# Altium project 2020Masterboard.PrjPcb
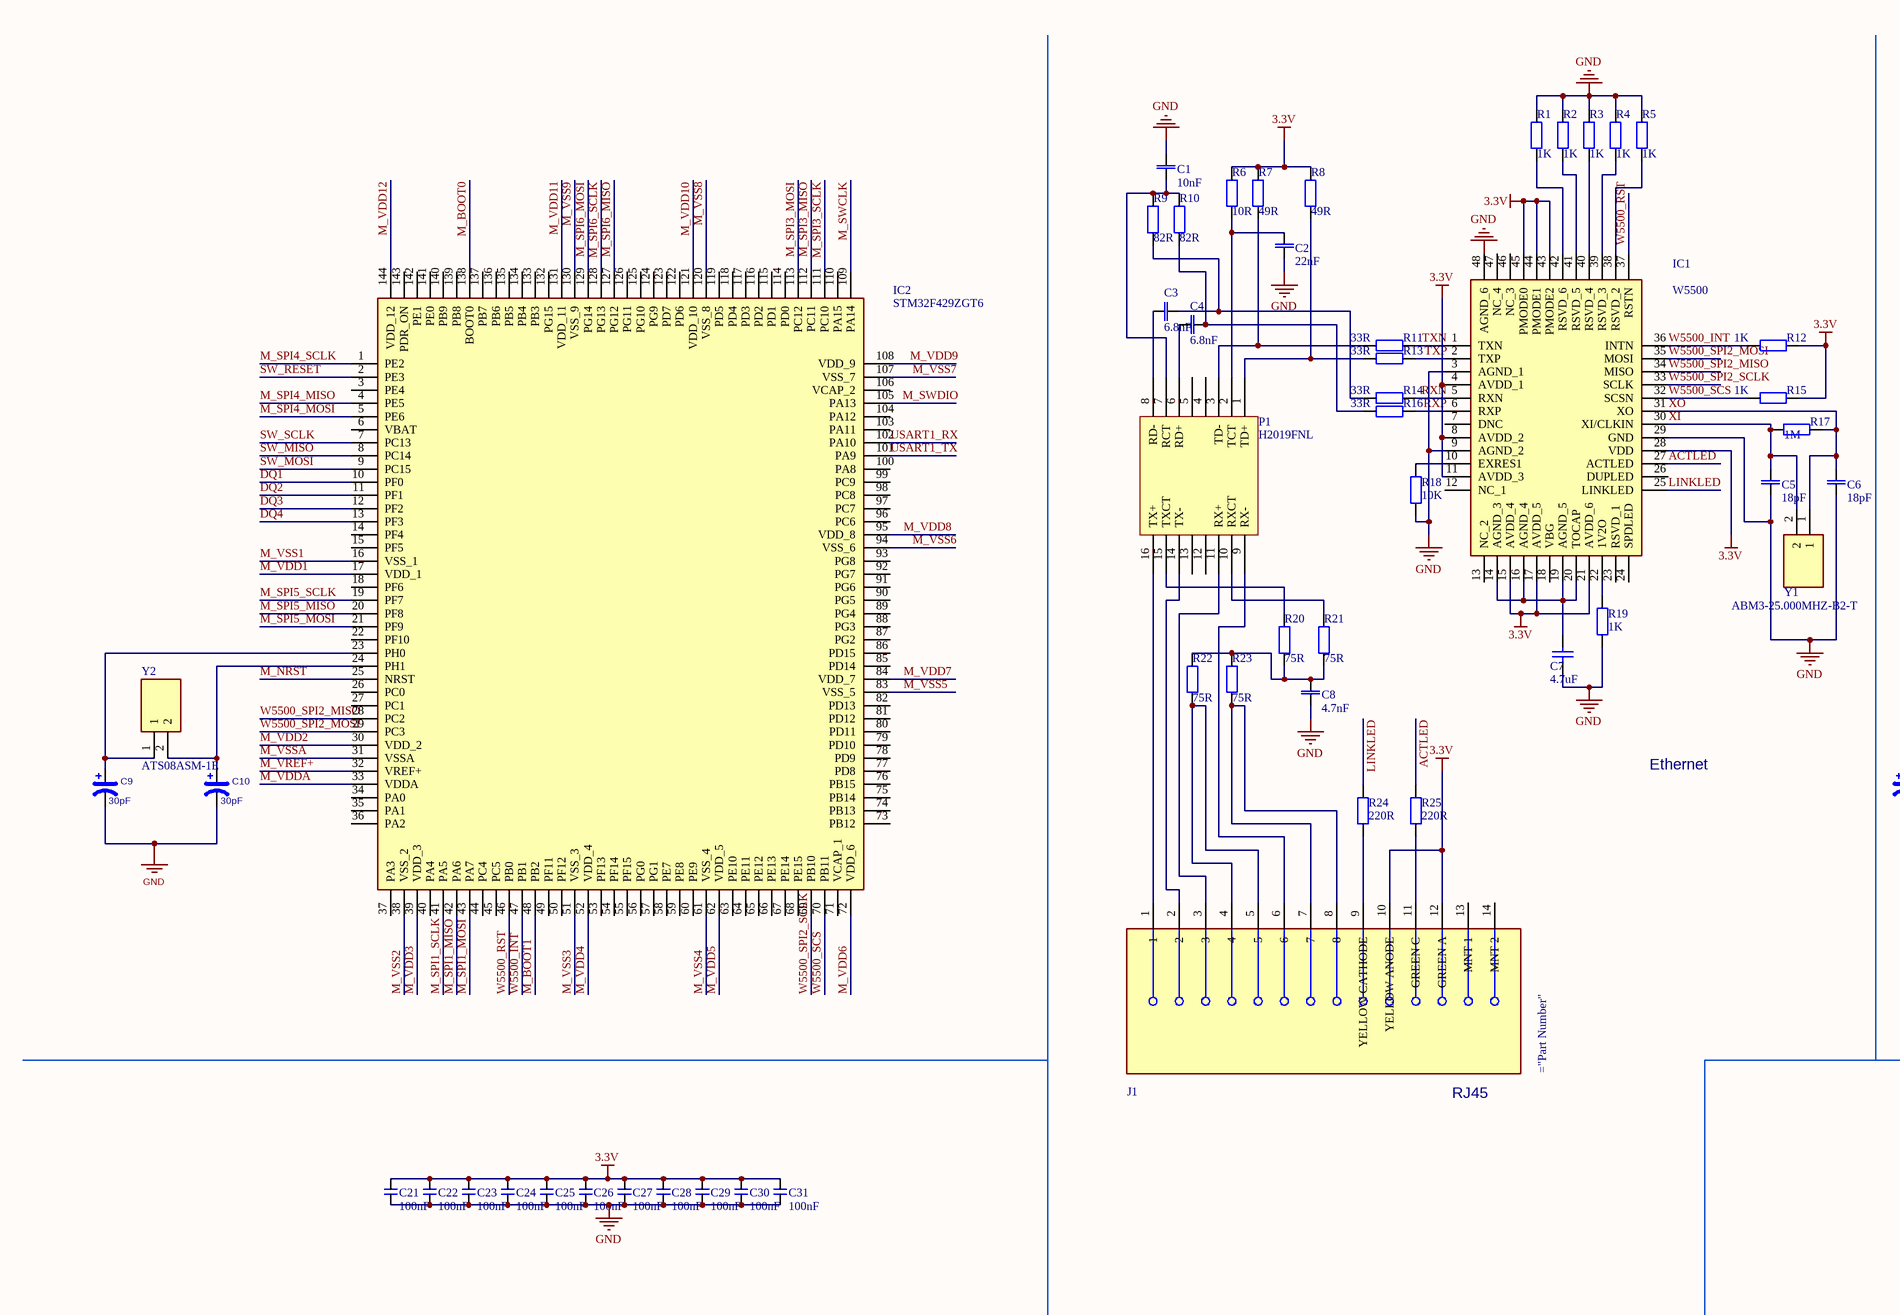
[diagram p0: all_Masterboard_2020.SchDoc, top column 1 of 4]
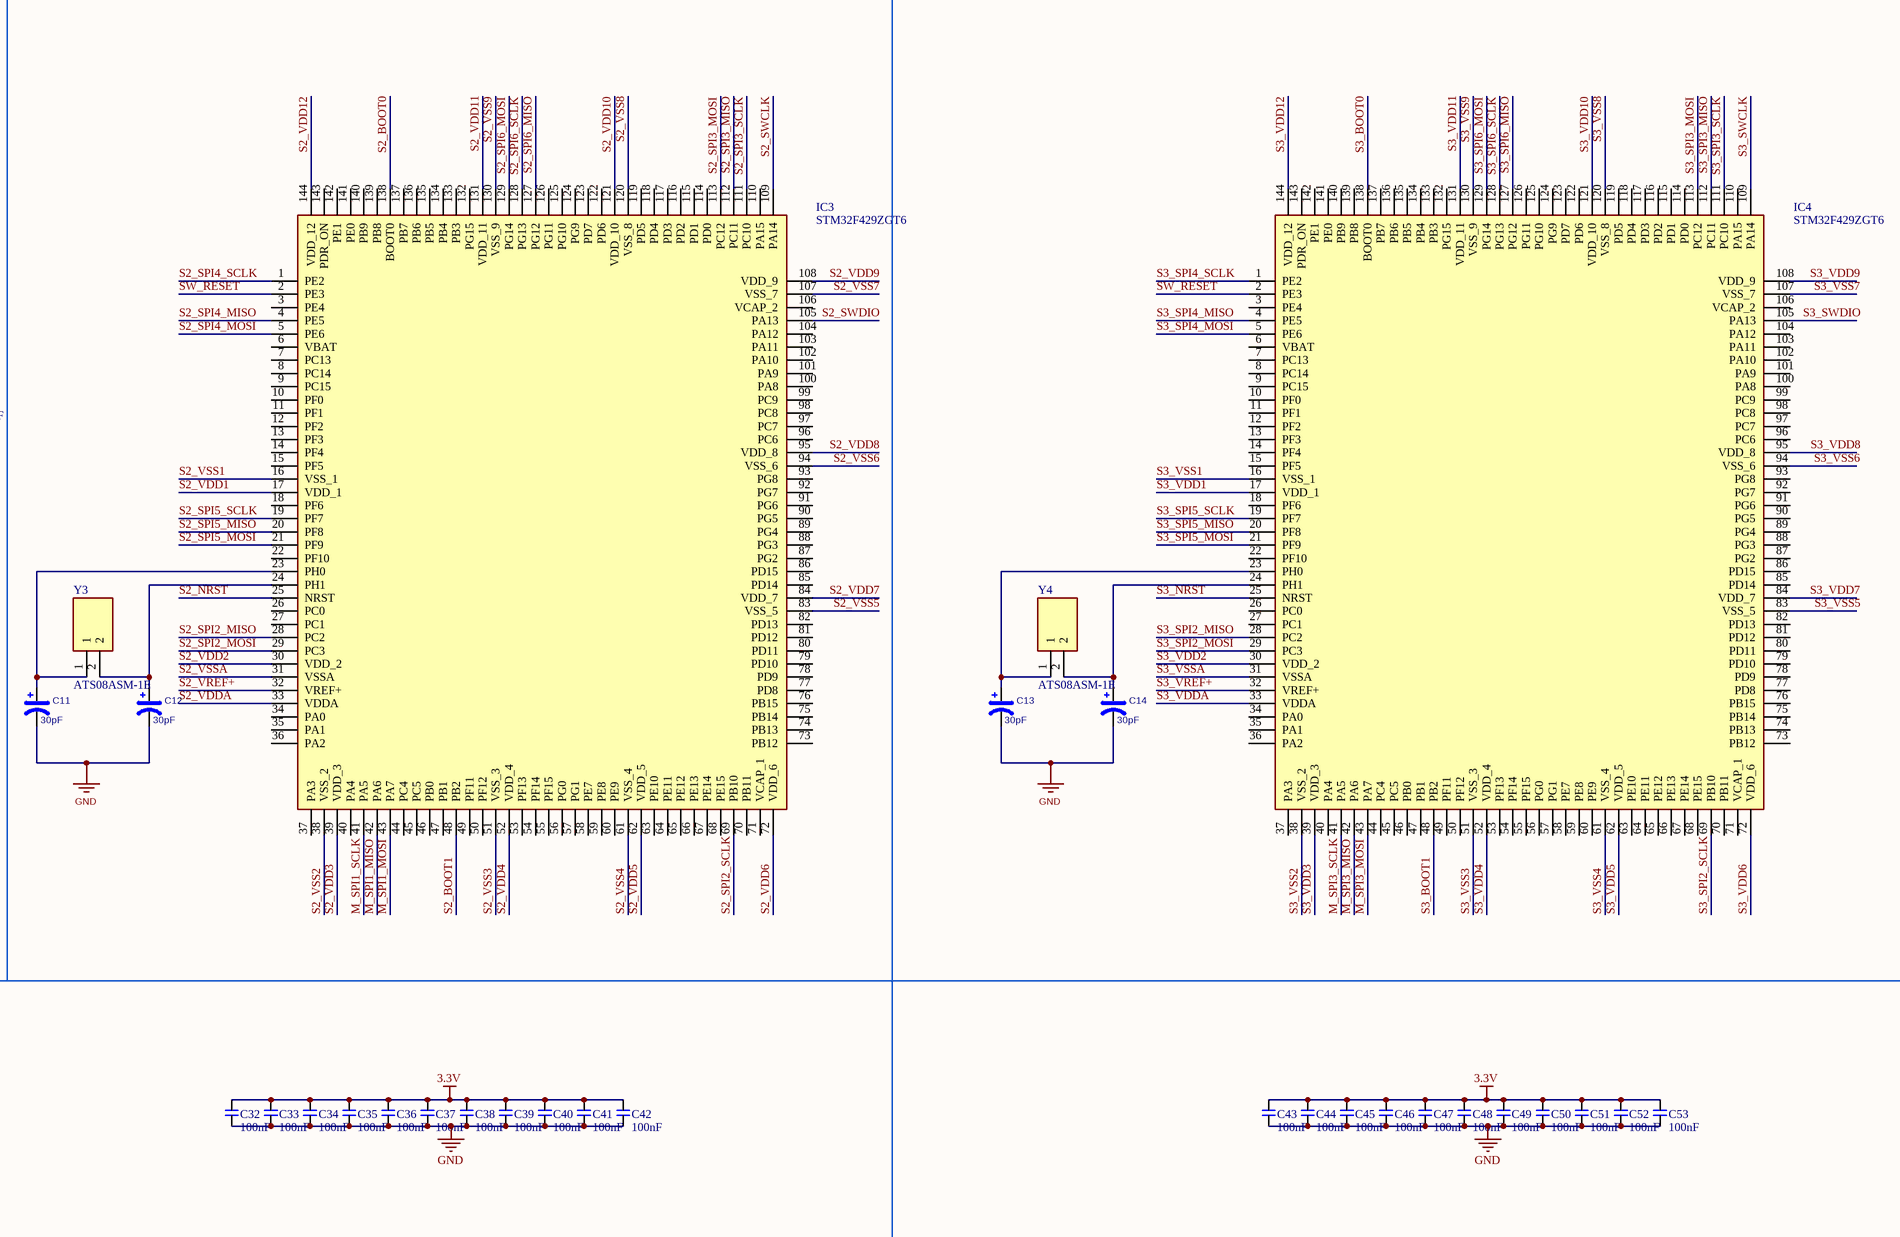
[diagram p1: all_Masterboard_2020.SchDoc, top column 2 of 4]
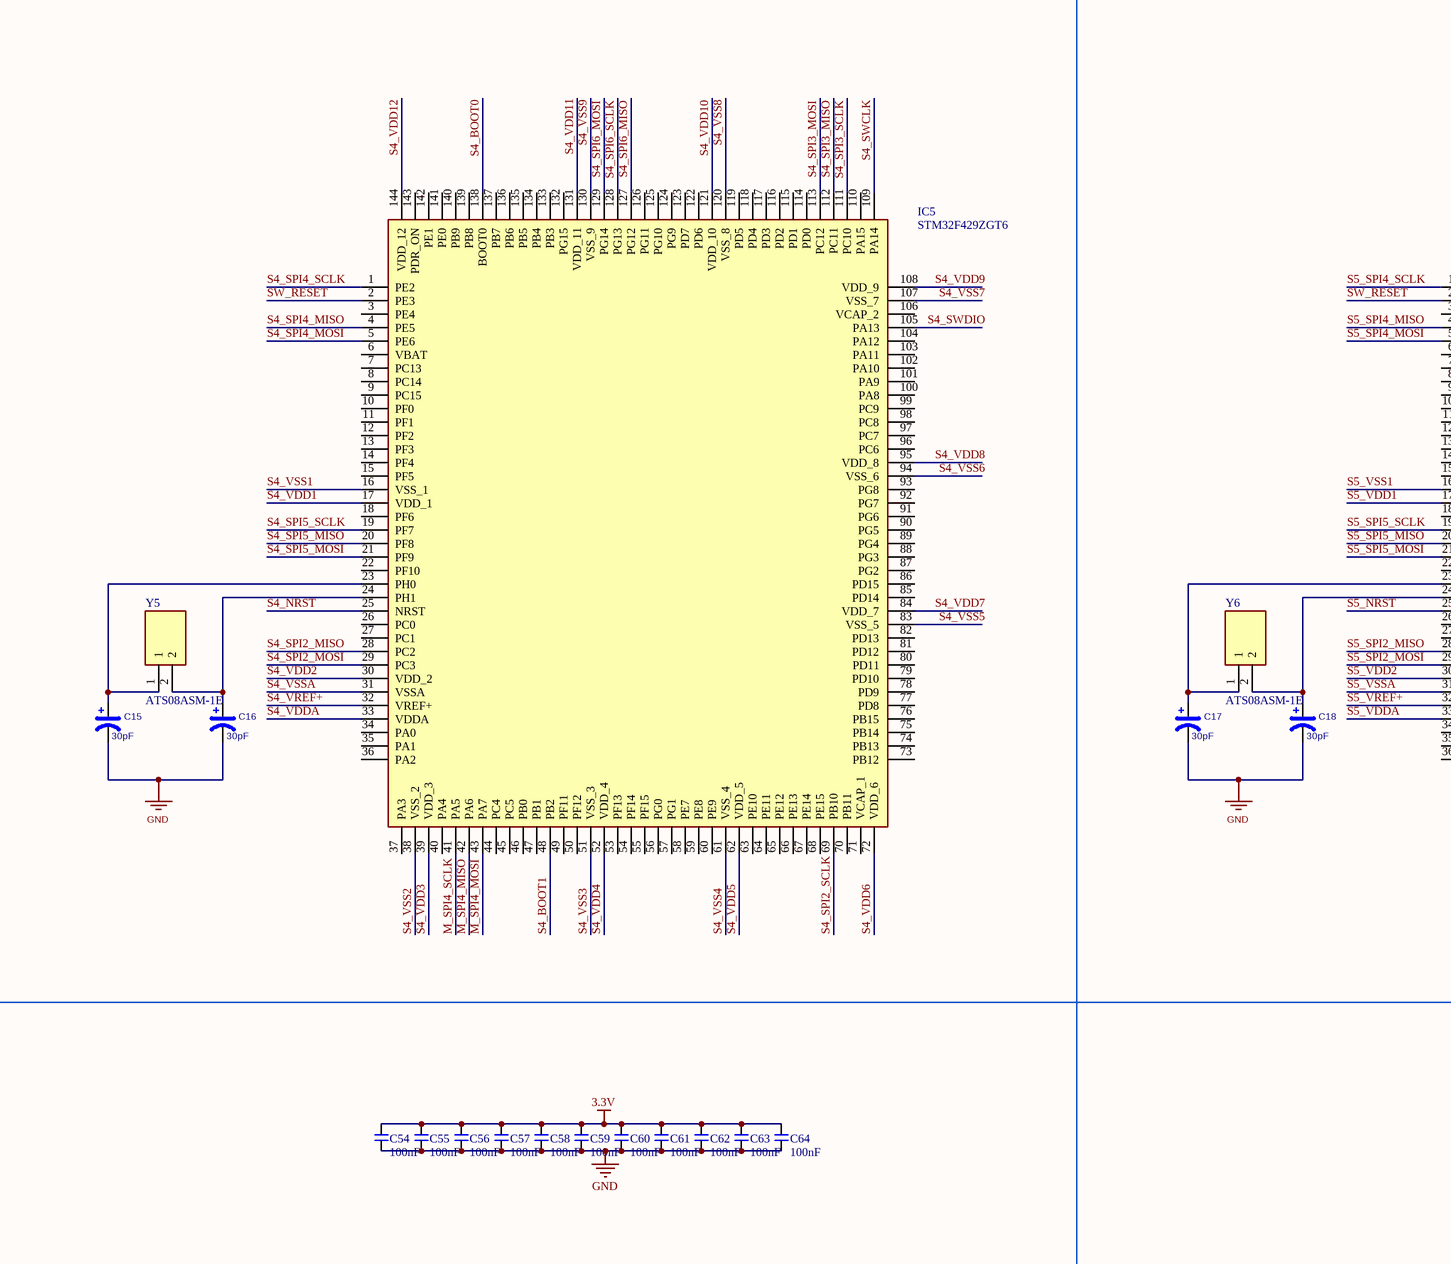
[diagram p2: all_Masterboard_2020.SchDoc, top column 3 of 4]
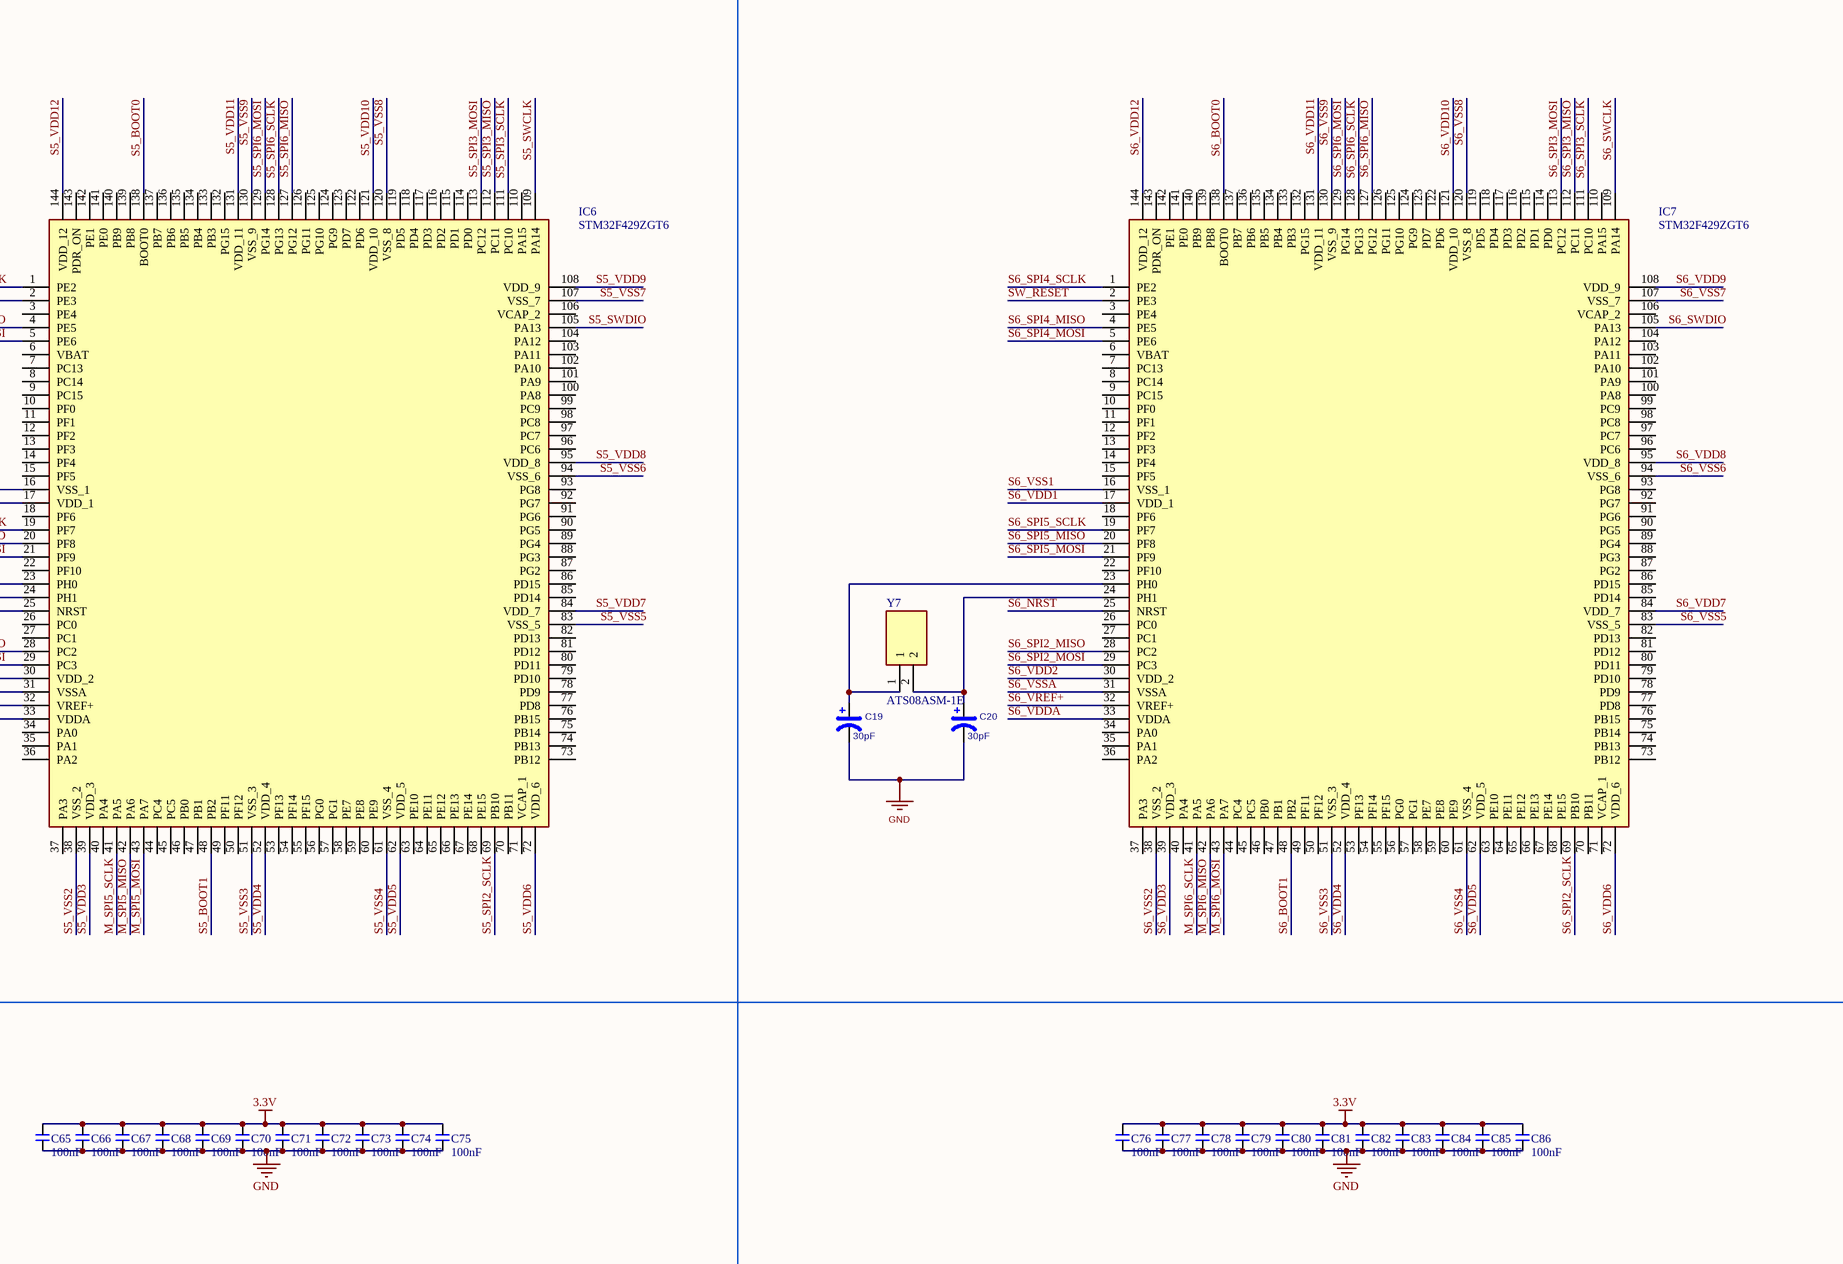
[diagram p3: all_Masterboard_2020.SchDoc, top column 4 of 4]
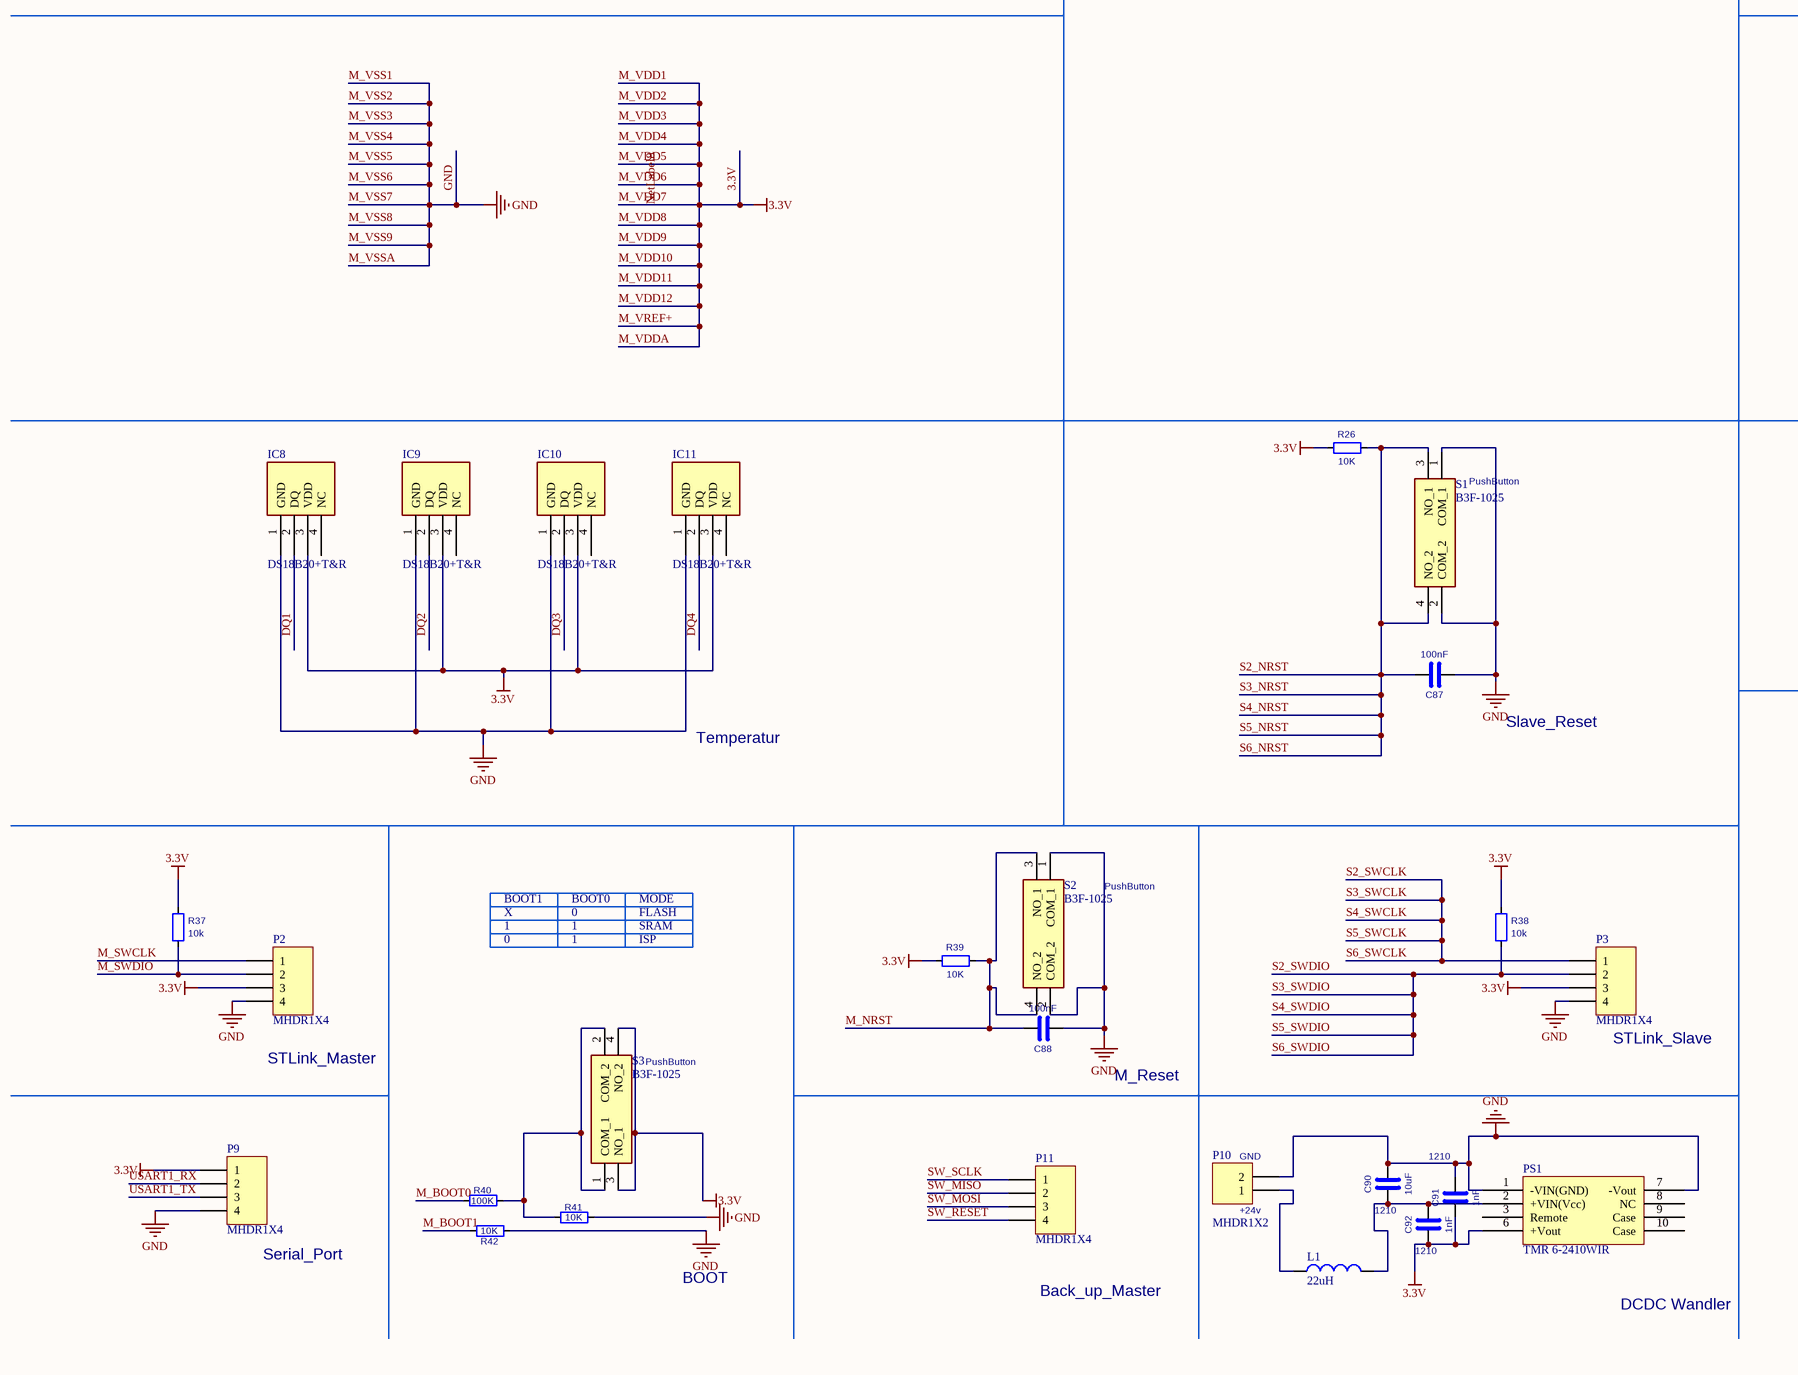
[diagram p4: all_Masterboard_2020.SchDoc, bottom column 1 of 4]
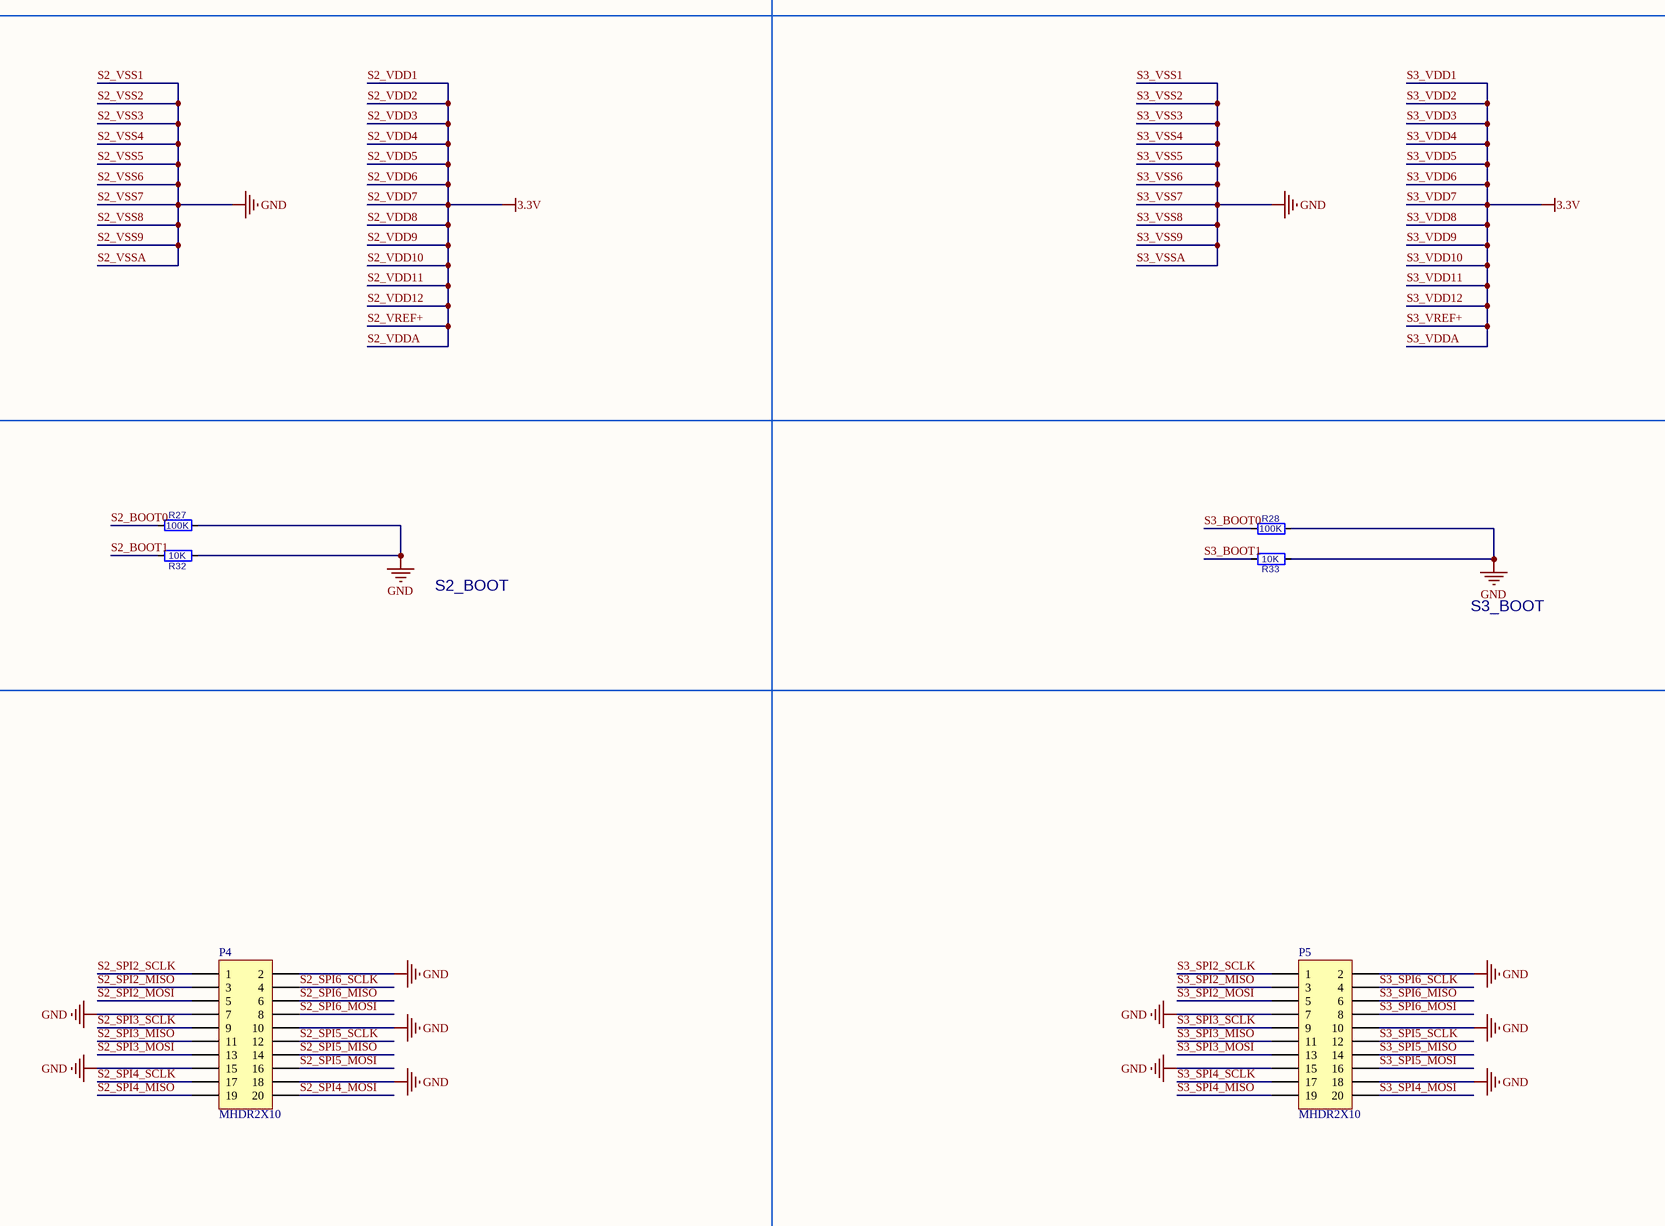
[diagram p5: all_Masterboard_2020.SchDoc, bottom column 2 of 4]
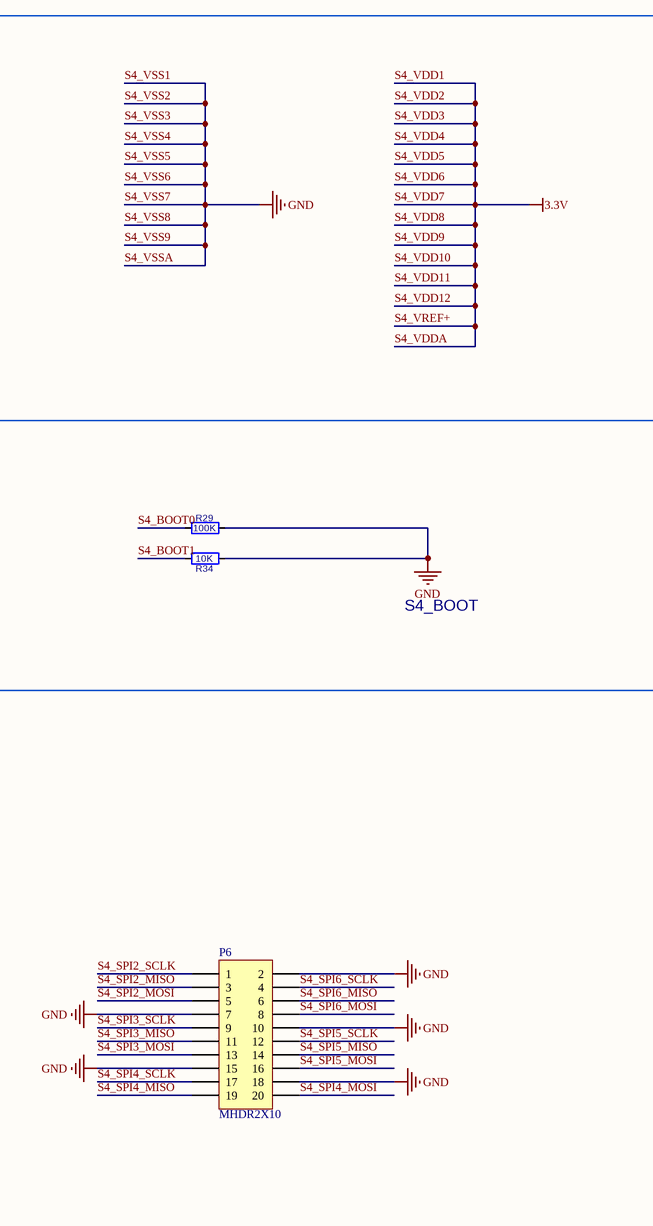
[diagram p6: all_Masterboard_2020.SchDoc, bottom column 3 of 4]
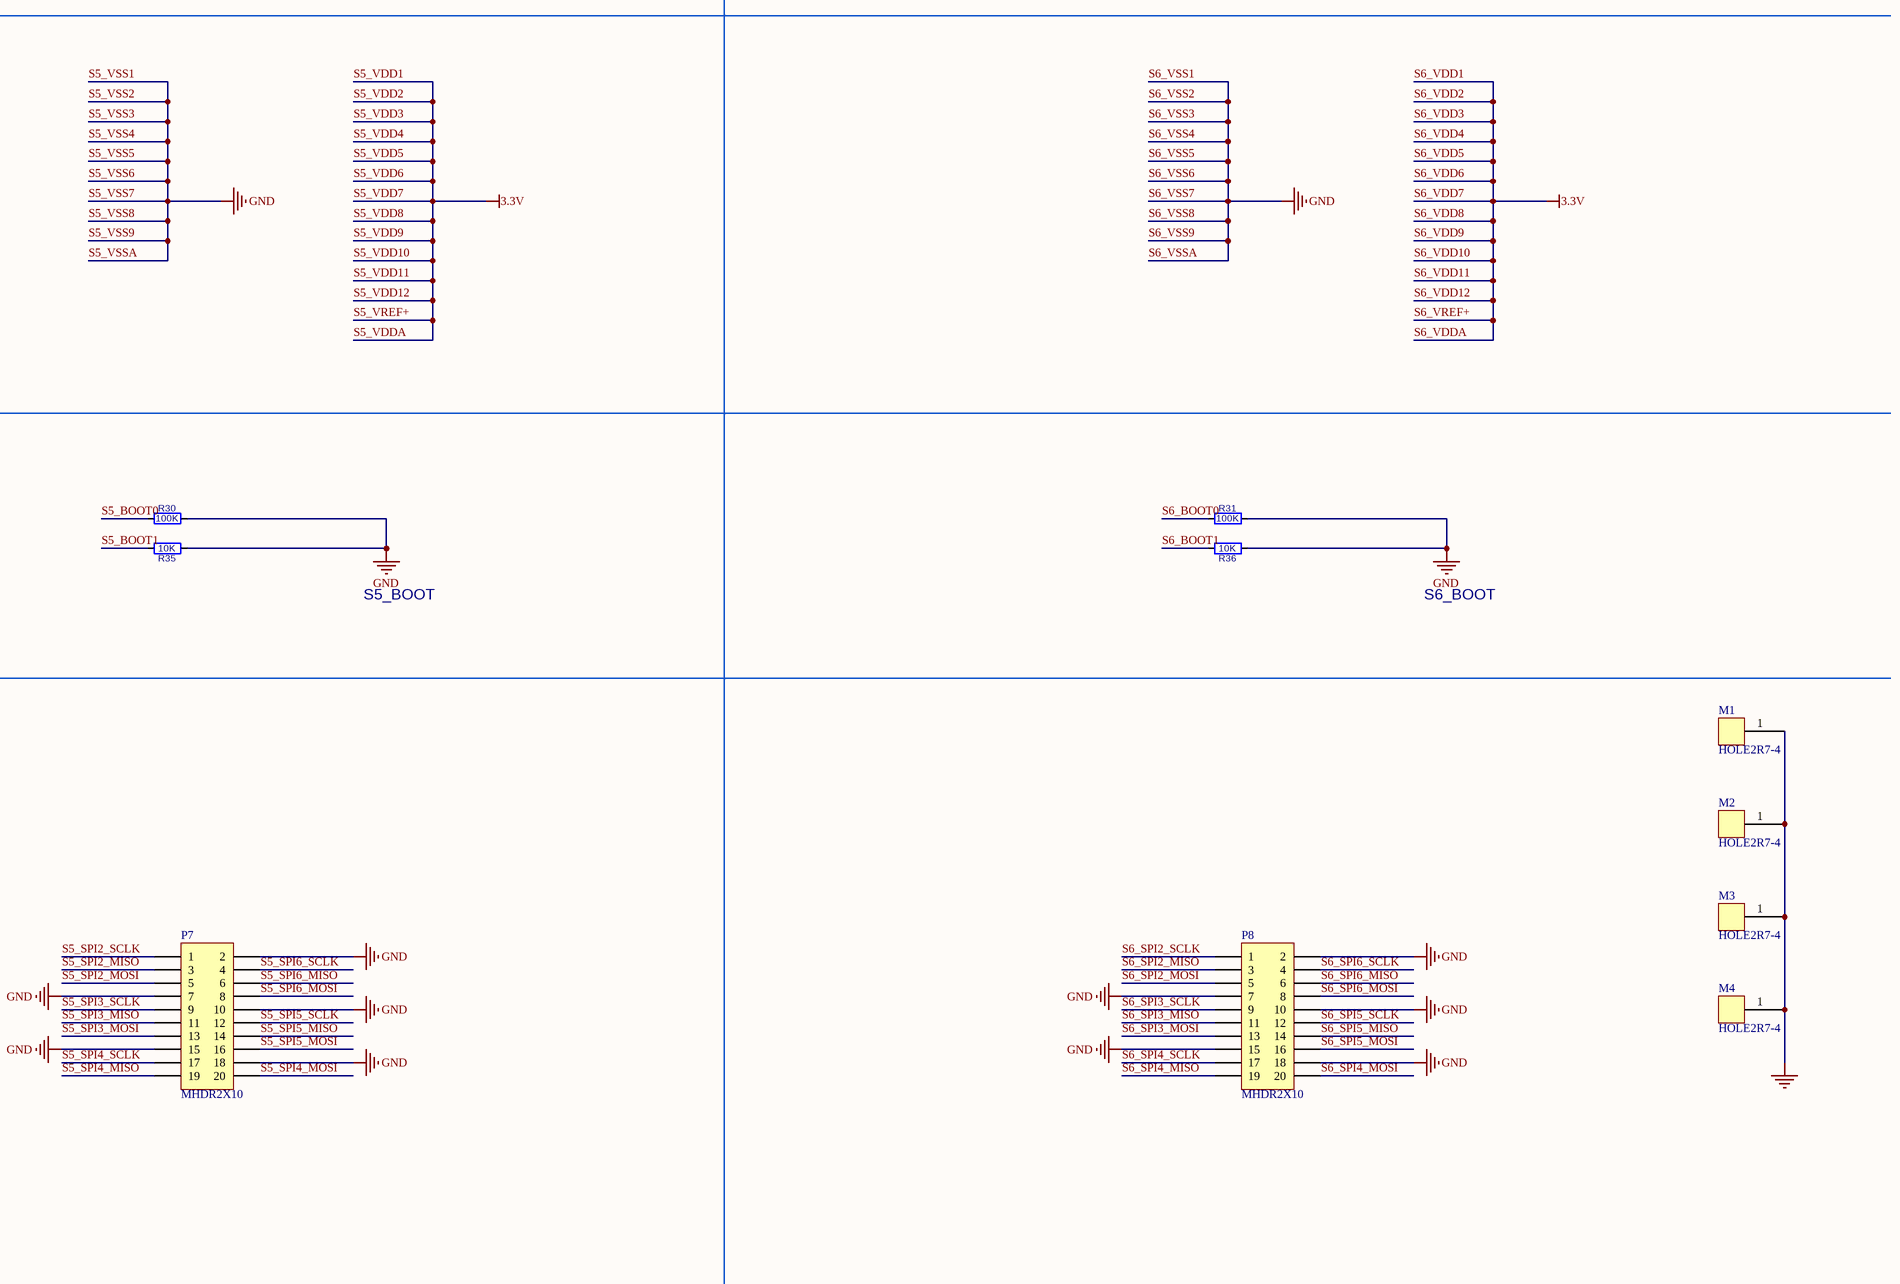
[diagram p7: all_Masterboard_2020.SchDoc, bottom column 4 of 4]
1 sheet, 172 parts. Net scope: global (net labels, ports and power ports of the same name join across sheets).
Board file: all_Masterboard_2020.PcbDoc

## Sheet all_Masterboard_2020.SchDoc
size 1371 x 508 mm

### Parts
C1  10nF  [C0603]
C2  value 22nF  [C0603]  (hidden comment: Tụ điện dán 080522nF)
C3  value 6.8nF  [C0603]  (hidden comment: 10nF)
C4  value 6.8nF  [C0603]  (hidden comment: 10nF)
C5  value 18pF  [C0603]  (hidden comment: Tụ điện dán 080518pF)
C6  value 18pF  [C0603]  (hidden comment: Tụ điện dán 080518pF)
C7  value 4.7uF  [C0603]  (hidden comment: 100pF)
C8  value 4.7nF  [C0603]  (hidden comment: Tụ điện dán 08054.7nF)
C9  30pF  [c0603]
C10  30pF  [c0603]
C11  30pF  [c0603]
C12  30pF  [c0603]
C13  30pF  [c0603]
C14  30pF  [c0603]
C15  30pF  [c0603]
C16  30pF  [c0603]
C17  30pF  [c0603]
C18  30pF  [c0603]
C19  30pF  [c0603]
C20  30pF  [c0603]
C21  100nF  [C0603]
C22  100nF  [C0603]
C23  100nF  [C0603]
C24  100nF  [C0603]
C25  100nF  [C0603]
C26  100nF  [C0603]
C27  100nF  [C0603]
C28  100nF  [C0603]
C29  100nF  [C0603]
C30  100nF  [C0603]
C31  100nF  [C0603]
C32  100nF  [C0603]
C33  100nF  [C0603]
C34  100nF  [C0603]
C35  100nF  [C0603]
C36  100nF  [C0603]
C37  100nF  [C0603]
C38  100nF  [C0603]
C39  100nF  [C0603]
C40  100nF  [C0603]
C41  100nF  [C0603]
C42  100nF  [C0603]
C43  100nF  [C0603]
C44  100nF  [C0603]
C45  100nF  [C0603]
C46  100nF  [C0603]
C47  100nF  [C0603]
C48  100nF  [C0603]
C49  100nF  [C0603]
C50  100nF  [C0603]
C51  100nF  [C0603]
C52  100nF  [C0603]
C53  100nF  [C0603]
C54  100nF  [C0603]
C55  100nF  [C0603]
C56  100nF  [C0603]
C57  100nF  [C0603]
C58  100nF  [C0603]
C59  100nF  [C0603]
C60  100nF  [C0603]
C61  100nF  [C0603]
C62  100nF  [C0603]
C63  100nF  [C0603]
C64  100nF  [C0603]
C65  100nF  [C0603]
C66  100nF  [C0603]
C67  100nF  [C0603]
C68  100nF  [C0603]
C69  100nF  [C0603]
C70  100nF  [C0603]
C71  100nF  [C0603]
C72  100nF  [C0603]
C73  100nF  [C0603]
C74  100nF  [C0603]
C75  100nF  [C0603]
C76  100nF  [C0603]
C77  100nF  [C0603]
C78  100nF  [C0603]
C79  100nF  [C0603]
C80  100nF  [C0603]
C81  100nF  [C0603]
C82  100nF  [C0603]
C83  100nF  [C0603]
C84  100nF  [C0603]
C85  100nF  [C0603]
C86  100nF  [C0603]
C87  100nF  [C0603]
C88  100nF  [C0603]
C90  10uF  [C1210]
C91  1nF  [C1210]
C92  1nF  [C1210]
IC1  W5500  [QFP50P900X900X160-48N]
IC2  STM32F429ZGT6  [QFP50P2200X2200X160-144N]
IC3  STM32F429ZGT6  [QFP50P2200X2200X160-144N]
IC4  STM32F429ZGT6  [QFP50P2200X2200X160-144N]
IC5  STM32F429ZGT6  [QFP50P2200X2200X160-144N]
IC6  STM32F429ZGT6  [QFP50P2200X2200X160-144N]
IC7  STM32F429ZGT6  [QFP50P2200X2200X160-144N]
IC8  DS18B20+T&R  [Conn4pin]
IC9  DS18B20+T&R  [Conn4pin]
IC10  DS18B20+T&R  [Conn4pin]
IC11  DS18B20+T&R  [Conn4pin]
J1  RJHSE-5381  [RJHSE5381]  (value not drawn)
L1  value 22uH  [L1_74404054220]  (hidden comment: Inductor)
M1  HOLE2R7-4  [HOLE2R7-4]
M2  HOLE2R7-4  [HOLE2R7-4]
M3  HOLE2R7-4  [HOLE2R7-4]
M4  HOLE2R7-4  [HOLE2R7-4]
P1  H2019FNL  [H2019FNL]
P2  MHDR1X4  [Conn4pin]
P3  MHDR1X4  [Conn4pin]
P4  MHDR2X10  [conn20pin]
P5  MHDR2X10  [conn20pin]
P6  MHDR2X10  [conn20pin]
P7  MHDR2X10  [conn20pin]
P8  MHDR2X10  [conn20pin]
P9  MHDR1X4  [Conn4pin]
P10  MHDR1X2  [pwrconn]
P11  MHDR1X4  [Conn4pin]
PS1  TMR 6-2410WIR  [TMR62410WIR]
R1  1K  [6-0805_N]
R2  1K  [6-0805_N]
R3  1K  [6-0805_N]
R4  1K  [6-0805_N]
R5  1K  [6-0805_N]
R6  value 10R  [6-0805_N]  (hidden comment: 49R)
R7  value 49R  [6-0805_N]  (hidden comment: 10R)
R8  49R  [6-0805_N]
R9  82R  [6-0805_N]
R10  82R  [6-0805_N]
R11  value 33R  [6-0805_N]  (hidden comment: 1K)
R12  1K  [6-0805_N]
R13  33R  [6-0805_N]
R14  33R  [6-0805_N]
R15  1K  [6-0805_N]
R16  33R  [6-0805_N]
R17  1M  [6-0805_N]
R18  10K  [6-0805_N]
R19  1K  [6-0805_N]
R20  75R  [6-0805_N]
R21  75R  [6-0805_N]
R22  75R  [6-0805_N]
R23  75R  [6-0805_N]
R24  value 220R  [6-0805_N]  (hidden comment: 75R)
R25  value 220R  [6-0805_N]  (hidden comment: 75R)
R26  10K  [6-0805_N]
R27  100K  [6-0805_N]
R28  100K  [6-0805_N]
R29  100K  [6-0805_N]
R30  100K  [6-0805_N]
R31  100K  [6-0805_N]
R32  10K  [6-0805_N]
R33  10K  [6-0805_N]
R34  10K  [6-0805_N]
R35  10K  [6-0805_N]
R36  10K  [6-0805_N]
R37  10k  [6-0805_N]
R38  10k  [6-0805_N]
R39  10K  [6-0805_N]
R40  100K  [6-0805_N]
R41  10K  [6-0805_N]
R42  10K  [6-0805_N]
S1  B3F-1025  [B3F1025]
S2  B3F-1025  [B3F1025]
S3  B3F-1025  [B3F1025]
Y1  ABM3-25.000MHZ-B2-T  [ABM325000MHZB2T]
Y2  ATS08ASM-1E  [ATS040SM1]
Y3  ATS08ASM-1E  [ATS040SM1]
Y4  ATS08ASM-1E  [ATS040SM1]
Y5  ATS08ASM-1E  [ATS040SM1]
Y6  ATS08ASM-1E  [ATS040SM1]
Y7  ATS08ASM-1E  [ATS040SM1]

### Nets
3.3V: C21.1 C22.1 C23.1 C24.1 C25.1 C26.1 C27.1 C28.1 C29.1 C30.1 C31.1 C32.1 C33.1 C34.1 C35.1 C36.1 C37.1 C38.1 C39.1 C40.1 C41.1 C42.1 C43.1 C44.1 C45.1 C46.1 C47.1 C48.1 C49.1 C50.1 C51.1 C52.1 C53.1 C54.1 C55.1 C56.1 C57.1 C58.1 C59.1 C60.1 C61.1 C62.1 C63.1 C64.1 C65.1 C66.1 C67.1 C68.1 C69.1 C70.1 C71.1 C72.1 C73.1 C74.1 C75.1 C76.1 C77.1 C78.1 C79.1 C80.1 C81.1 C82.1 C83.1 C84.1 C85.1 C86.1 C91.2 C92.2 IC1.4(AVDD_1) IC1.8(AVDD_2) IC1.11(AVDD_3) IC1.15(AVDD_4) IC1.17(AVDD_5) IC1.21(AVDD_6) IC1.28(VDD) IC1.43(PMODE2) IC1.44(PMODE1) IC1.45(PMODE0) IC2.17(VDD_1) IC2.30(VDD_2) IC2.32(VREF+) IC2.33(VDDA) IC2.39(VDD_3) IC2.52(VDD_4) IC2.62(VDD_5) IC2.72(VDD_6) IC2.84(VDD_7) IC2.95(VDD_8) IC2.108(VDD_9) IC2.121(VDD_10) IC2.131(VDD_11) IC2.144(VDD_12) IC3.17(VDD_1) IC3.30(VDD_2) IC3.32(VREF+) IC3.33(VDDA) IC3.39(VDD_3) IC3.52(VDD_4) IC3.62(VDD_5) IC3.72(VDD_6) IC3.84(VDD_7) IC3.95(VDD_8) IC3.108(VDD_9) IC3.121(VDD_10) IC3.131(VDD_11) IC3.144(VDD_12) IC4.17(VDD_1) IC4.30(VDD_2) IC4.32(VREF+) IC4.33(VDDA) IC4.39(VDD_3) IC4.52(VDD_4) IC4.62(VDD_5) IC4.72(VDD_6) IC4.84(VDD_7) IC4.95(VDD_8) IC4.108(VDD_9) IC4.121(VDD_10) IC4.131(VDD_11) IC4.144(VDD_12) IC5.17(VDD_1) IC5.30(VDD_2) IC5.32(VREF+) IC5.33(VDDA) IC5.39(VDD_3) IC5.52(VDD_4) IC5.62(VDD_5) IC5.72(VDD_6) IC5.84(VDD_7) IC5.95(VDD_8) IC5.108(VDD_9) IC5.121(VDD_10) IC5.131(VDD_11) IC5.144(VDD_12) IC6.17(VDD_1) IC6.30(VDD_2) IC6.32(VREF+) IC6.33(VDDA) IC6.39(VDD_3) IC6.52(VDD_4) IC6.62(VDD_5) IC6.72(VDD_6) IC6.84(VDD_7) IC6.95(VDD_8) IC6.108(VDD_9) IC6.121(VDD_10) IC6.131(VDD_11) IC6.144(VDD_12) IC7.17(VDD_1) IC7.30(VDD_2) IC7.32(VREF+) IC7.33(VDDA) IC7.39(VDD_3) IC7.52(VDD_4) IC7.62(VDD_5) IC7.72(VDD_6) IC7.84(VDD_7) IC7.95(VDD_8) IC7.108(VDD_9) IC7.121(VDD_10) IC7.131(VDD_11) IC7.144(VDD_12) IC8.3(VDD) IC9.3(VDD) IC10.3(VDD) IC11.3(VDD) J1.10(YELLOW_ANODE) J1.12(GREEN_A) P2.3 P3.3 P9.1 PS1.6(+Vout) R6.2 R7.2 R8.2 R12.2 R15.2 R26.2 R37.1 R38.1 R39.2 S3.3(NO_1) S3.4(NO_2)  [also labelled M_VDD1, M_VDD10, M_VDD11, M_VDD12, M_VDD2, M_VDD3, M_VDD4, M_VDD5, M_VDD6, M_VDD7, M_VDD8, M_VDD9, M_VDDA, M_VREF+, NetLabel8, S2_VDD1, S2_VDD10, S2_VDD11, S2_VDD12, S2_VDD2, S2_VDD3, S2_VDD4, S2_VDD5, S2_VDD6, S2_VDD7, S2_VDD8, S2_VDD9, S2_VDDA, S2_VREF+, S3_VDD1, S3_VDD10, S3_VDD11, S3_VDD12, S3_VDD2, S3_VDD3, S3_VDD4, S3_VDD5, S3_VDD6, S3_VDD7, S3_VDD8, S3_VDD9, S3_VDDA, S3_VREF+, S4_VDD1, S4_VDD10, S4_VDD11, S4_VDD12, S4_VDD2, S4_VDD3, S4_VDD4, S4_VDD5, S4_VDD6, S4_VDD7, S4_VDD8, S4_VDD9, S4_VDDA, S4_VREF+, S5_VDD1, S5_VDD10, S5_VDD11, S5_VDD12, S5_VDD2, S5_VDD3, S5_VDD4, S5_VDD5, S5_VDD6, S5_VDD7, S5_VDD8, S5_VDD9, S5_VDDA, S5_VREF+, S6_VDD1, S6_VDD10, S6_VDD11, S6_VDD12, S6_VDD2, S6_VDD3, S6_VDD4, S6_VDD5, S6_VDD6, S6_VDD7, S6_VDD8, S6_VDD9, S6_VDDA, S6_VREF+]
GND: C1.2 C2.1 C5.1 C6.1 C7.2 C8.1 C9.2 C10.2 C11.2 C12.2 C13.2 C14.2 C15.2 C16.2 C17.2 C18.2 C19.2 C20.2 C21.2 C22.2 C23.2 C24.2 C25.2 C26.2 C27.2 C28.2 C29.2 C30.2 C31.2 C32.2 C33.2 C34.2 C35.2 C36.2 C37.2 C38.2 C39.2 C40.2 C41.2 C42.2 C43.2 C44.2 C45.2 C46.2 C47.2 C48.2 C49.2 C50.2 C51.2 C52.2 C53.2 C54.2 C55.2 C56.2 C57.2 C58.2 C59.2 C60.2 C61.2 C62.2 C63.2 C64.2 C65.2 C66.2 C67.2 C68.2 C69.2 C70.2 C71.2 C72.2 C73.2 C74.2 C75.2 C76.2 C77.2 C78.2 C79.2 C80.2 C81.2 C82.2 C83.2 C84.2 C85.2 C86.2 C87.2 C88.2 C90.1 C91.1 IC1.3(AGND_1) IC1.9(AGND_2) IC1.29(GND) IC1.48(AGND_6) IC2.16(VSS_1) IC2.31(VSSA) IC2.38(VSS_2) IC2.51(VSS_3) IC2.61(VSS_4) IC2.83(VSS_5) IC2.94(VSS_6) IC2.107(VSS_7) IC2.120(VSS_8) IC2.130(VSS_9) IC3.16(VSS_1) IC3.31(VSSA) IC3.38(VSS_2) IC3.51(VSS_3) IC3.61(VSS_4) IC3.83(VSS_5) IC3.94(VSS_6) IC3.107(VSS_7) IC3.120(VSS_8) IC3.130(VSS_9) IC4.16(VSS_1) IC4.31(VSSA) IC4.38(VSS_2) IC4.51(VSS_3) IC4.61(VSS_4) IC4.83(VSS_5) IC4.94(VSS_6) IC4.107(VSS_7) IC4.120(VSS_8) IC4.130(VSS_9) IC5.16(VSS_1) IC5.31(VSSA) IC5.38(VSS_2) IC5.51(VSS_3) IC5.61(VSS_4) IC5.83(VSS_5) IC5.94(VSS_6) IC5.107(VSS_7) IC5.120(VSS_8) IC5.130(VSS_9) IC6.16(VSS_1) IC6.31(VSSA) IC6.38(VSS_2) IC6.51(VSS_3) IC6.61(VSS_4) IC6.83(VSS_5) IC6.94(VSS_6) IC6.107(VSS_7) IC6.120(VSS_8) IC6.130(VSS_9) IC7.16(VSS_1) IC7.31(VSSA) IC7.38(VSS_2) IC7.51(VSS_3) IC7.61(VSS_4) IC7.83(VSS_5) IC7.94(VSS_6) IC7.107(VSS_7) IC7.120(VSS_8) IC7.130(VSS_9) IC8.1(GND) IC9.1(GND) IC10.1(GND) IC11.1(GND) M1.1 M2.1 M3.1 M4.1 P2.4 P3.4 P4.2 P4.7 P4.10 P4.15 P4.18 P5.2 P5.7 P5.10 P5.15 P5.18 P6.2 P6.7 P6.10 P6.15 P6.18 P7.2 P7.7 P7.10 P7.15 P7.18 P8.2 P8.7 P8.10 P8.15 P8.18 P9.4 P10.2 PS1.1(-VIN(GND)) PS1.7(-Vout) R1.2 R2.2 R3.2 R4.2 R5.2 R18.1 R19.1 R27.1 R28.1 R29.1 R30.1 R31.1 R32.2 R33.2 R34.2 R35.2 R36.2 R41.1 R42.2 S1.1(COM_1) S1.2(COM_2) S2.1(COM_1) S2.2(COM_2)  [also labelled M_VSS1, M_VSS2, M_VSS3, M_VSS4, M_VSS5, M_VSS6, M_VSS7, M_VSS8, M_VSS9, M_VSSA, S2_VSS1, S2_VSS2, S2_VSS3, S2_VSS4, S2_VSS5, S2_VSS6, S2_VSS7, S2_VSS8, S2_VSS9, S2_VSSA, S3_VSS1, S3_VSS2, S3_VSS3, S3_VSS4, S3_VSS5, S3_VSS6, S3_VSS7, S3_VSS8, S3_VSS9, S3_VSSA, S4_VSS1, S4_VSS2, S4_VSS3, S4_VSS4, S4_VSS5, S4_VSS6, S4_VSS7, S4_VSS8, S4_VSS9, S4_VSSA, S5_VSS1, S5_VSS2, S5_VSS3, S5_VSS4, S5_VSS5, S5_VSS6, S5_VSS7, S5_VSS8, S5_VSS9, S5_VSSA, S6_VSS1, S6_VSS2, S6_VSS3, S6_VSS4, S6_VSS5, S6_VSS6, S6_VSS7, S6_VSS8, S6_VSS9, S6_VSSA]
ACTLED: IC1.27(ACTLED) R25.2
DQ1: IC2.10(PF0) IC8.2(DQ)
DQ2: IC2.11(PF1) IC9.2(DQ)
DQ3: IC2.12(PF2) IC10.2(DQ)
DQ4: IC2.13(PF3) IC11.2(DQ)
LINKLED: IC1.25(LINKLED) R24.2
M_BOOT0: IC2.138(BOOT0) R40.2
M_BOOT1: IC2.48(PB2) R42.1
M_NRST: C88.1 IC2.25(NRST) R39.1 S2.3(NO_1) S2.4(NO_2)
M_SPI1_MISO: IC2.42(PA6) IC3.42(PA6)
M_SPI1_MOSI: IC2.43(PA7) IC3.43(PA7)
M_SPI1_SCLK: IC2.41(PA5) IC3.41(PA5)
M_SPI3_MISO: IC2.112(PC11) IC4.42(PA6)
M_SPI3_MOSI: IC2.113(PC12) IC4.43(PA7)
M_SPI3_SCLK: IC2.111(PC10) IC4.41(PA5)
M_SPI4_MISO: IC2.4(PE5) IC5.42(PA6)
M_SPI4_MOSI: IC2.5(PE6) IC5.43(PA7)
M_SPI4_SCLK: IC2.1(PE2) IC5.41(PA5)
M_SPI5_MISO: IC2.20(PF8) IC6.42(PA6)
M_SPI5_MOSI: IC2.21(PF9) IC6.43(PA7)
M_SPI5_SCLK: IC2.19(PF7) IC6.41(PA5)
M_SPI6_MISO: IC2.127(PG12) IC7.42(PA6)
M_SPI6_MOSI: IC2.129(PG14) IC7.43(PA7)
M_SPI6_SCLK: IC2.128(PG13) IC7.41(PA5)
M_SWCLK: IC2.109(PA14) P2.1
M_SWDIO: IC2.105(PA13) P2.2 R37.2
RXN: IC1.5(RXN) R14.2
RXP: IC1.6(RXP) R16.2
S2_BOOT0: IC3.138(BOOT0) R27.2
S2_BOOT1: IC3.48(PB2) R32.1
S2_NRST: C87.1 IC3.25(NRST) IC4.25(NRST) IC5.25(NRST) IC6.25(NRST) IC7.25(NRST) R26.1 S1.3(NO_1) S1.4(NO_2)  [also labelled S3_NRST, S4_NRST, S5_NRST, S6_NRST]
S2_SPI2_MISO: IC3.28(PC2) P4.3
S2_SPI2_MOSI: IC3.29(PC3) P4.5
S2_SPI2_SCLK: IC3.69(PB10) P4.1
S2_SPI3_MISO: IC3.112(PC11) P4.11
S2_SPI3_MOSI: IC3.113(PC12) P4.13
S2_SPI3_SCLK: IC3.111(PC10) P4.9
S2_SPI4_MISO: IC3.4(PE5) P4.19
S2_SPI4_MOSI: IC3.5(PE6) P4.20
S2_SPI4_SCLK: IC3.1(PE2) P4.17
S2_SPI5_MISO: IC3.20(PF8) P4.14
S2_SPI5_MOSI: IC3.21(PF9) P4.16
S2_SPI5_SCLK: IC3.19(PF7) P4.12
S2_SPI6_MISO: IC3.127(PG12) P4.6
S2_SPI6_MOSI: IC3.129(PG14) P4.8
S2_SPI6_SCLK: IC3.128(PG13) P4.4
S2_SWCLK: IC3.109(PA14) IC4.109(PA14) IC5.109(PA14) IC6.109(PA14) IC7.109(PA14) P3.1  [also labelled S3_SWCLK, S4_SWCLK, S5_SWCLK, S6_SWCLK]
S2_SWDIO: IC3.105(PA13) IC4.105(PA13) IC5.105(PA13) IC6.105(PA13) IC7.105(PA13) P3.2 R38.2  [also labelled S3_SWDIO, S4_SWDIO, S5_SWDIO, S6_SWDIO]
S3_BOOT0: IC4.138(BOOT0) R28.2
S3_BOOT1: IC4.48(PB2) R33.1
S3_SPI2_MISO: IC4.28(PC2) P5.3
S3_SPI2_MOSI: IC4.29(PC3) P5.5
S3_SPI2_SCLK: IC4.69(PB10) P5.1
S3_SPI3_MISO: IC4.112(PC11) P5.11
S3_SPI3_MOSI: IC4.113(PC12) P5.13
S3_SPI3_SCLK: IC4.111(PC10) P5.9
S3_SPI4_MISO: IC4.4(PE5) P5.19
S3_SPI4_MOSI: IC4.5(PE6) P5.20
S3_SPI4_SCLK: IC4.1(PE2) P5.17
S3_SPI5_MISO: IC4.20(PF8) P5.14
S3_SPI5_MOSI: IC4.21(PF9) P5.16
S3_SPI5_SCLK: IC4.19(PF7) P5.12
S3_SPI6_MISO: IC4.127(PG12) P5.6
S3_SPI6_MOSI: IC4.129(PG14) P5.8
S3_SPI6_SCLK: IC4.128(PG13) P5.4
S4_BOOT0: IC5.138(BOOT0) R29.2
S4_BOOT1: IC5.48(PB2) R34.1
S4_SPI2_MISO: IC5.28(PC2) P6.3
S4_SPI2_MOSI: IC5.29(PC3) P6.5
S4_SPI2_SCLK: IC5.69(PB10) P6.1
S4_SPI3_MISO: IC5.112(PC11) P6.11
S4_SPI3_MOSI: IC5.113(PC12) P6.13
S4_SPI3_SCLK: IC5.111(PC10) P6.9
S4_SPI4_MISO: IC5.4(PE5) P6.19
S4_SPI4_MOSI: IC5.5(PE6) P6.20
S4_SPI4_SCLK: IC5.1(PE2) P6.17
S4_SPI5_MISO: IC5.20(PF8) P6.14
S4_SPI5_MOSI: IC5.21(PF9) P6.16
S4_SPI5_SCLK: IC5.19(PF7) P6.12
S4_SPI6_MISO: IC5.127(PG12) P6.6
S4_SPI6_MOSI: IC5.129(PG14) P6.8
S4_SPI6_SCLK: IC5.128(PG13) P6.4
S5_BOOT0: IC6.138(BOOT0) R30.2
S5_BOOT1: IC6.48(PB2) R35.1
S5_SPI2_MISO: IC6.28(PC2) P7.3
S5_SPI2_MOSI: IC6.29(PC3) P7.5
S5_SPI2_SCLK: IC6.69(PB10) P7.1
S5_SPI3_MISO: IC6.112(PC11) P7.11
S5_SPI3_MOSI: IC6.113(PC12) P7.13
S5_SPI3_SCLK: IC6.111(PC10) P7.9
S5_SPI4_MISO: IC6.4(PE5) P7.19
S5_SPI4_MOSI: IC6.5(PE6) P7.20
S5_SPI4_SCLK: IC6.1(PE2) P7.17
S5_SPI5_MISO: IC6.20(PF8) P7.14
S5_SPI5_MOSI: IC6.21(PF9) P7.16
S5_SPI5_SCLK: IC6.19(PF7) P7.12
S5_SPI6_MISO: IC6.127(PG12) P7.6
S5_SPI6_MOSI: IC6.129(PG14) P7.8
S5_SPI6_SCLK: IC6.128(PG13) P7.4
S6_BOOT0: IC7.138(BOOT0) R31.2
S6_BOOT1: IC7.48(PB2) R36.1
S6_SPI2_MISO: IC7.28(PC2) P8.3
S6_SPI2_MOSI: IC7.29(PC3) P8.5
S6_SPI2_SCLK: IC7.69(PB10) P8.1
S6_SPI3_MISO: IC7.112(PC11) P8.11
S6_SPI3_MOSI: IC7.113(PC12) P8.13
S6_SPI3_SCLK: IC7.111(PC10) P8.9
S6_SPI4_MISO: IC7.4(PE5) P8.19
S6_SPI4_MOSI: IC7.5(PE6) P8.20
S6_SPI4_SCLK: IC7.1(PE2) P8.17
S6_SPI5_MISO: IC7.20(PF8) P8.14
S6_SPI5_MOSI: IC7.21(PF9) P8.16
S6_SPI5_SCLK: IC7.19(PF7) P8.12
S6_SPI6_MISO: IC7.127(PG12) P8.6
S6_SPI6_MOSI: IC7.129(PG14) P8.8
S6_SPI6_SCLK: IC7.128(PG13) P8.4
SW_MISO: IC2.8(PC14) P11.2
SW_MOSI: IC2.9(PC15) P11.3
SW_RESET: IC2.2(PE3) IC3.2(PE3) IC4.2(PE3) IC5.2(PE3) IC6.2(PE3) IC7.2(PE3) P11.4
SW_SCLK: IC2.7(PC13) P11.1
TXN: IC1.1(TXN) R11.2
TXP: IC1.2(TXP) R13.2
USART1_RX: IC2.102(PA10) P9.2
USART1_TX: IC2.101(PA9) P9.3
W5500_INT: IC1.36(INTN) IC2.47(PB1) R12.1
W5500_RST: IC1.37(RSTN) IC2.46(PB0)
W5500_SCS: IC1.32(SCSN) IC2.70(PB11) R15.1
W5500_SPI2_MISO: IC1.34(MISO) IC2.28(PC2)
W5500_SPI2_MOSI: IC1.35(MOSI) IC2.29(PC3)
W5500_SPI2_SCLK: IC1.33(SCLK) IC2.69(PB10)
XI: C5.2 IC1.30(XI/CLKIN) R17.1 Y1.2
XO: C6.2 IC1.31(XO) R17.2 Y1.1
NetC1_1: C1.1 P1.7(RCT) R9.2 R10.2
NetC2_2: C2.2 P1.2(TCT) R6.1
NetC3_1: C3.1 R9.1 R14.1
NetC3_2: C3.2 P1.8(RD-)
NetC4_1: C4.1 R10.1 R16.1
NetC4_2: C4.2 P1.6(RD+)
NetC7_1: C7.1 IC1.14(AGND_3) IC1.16(AGND_4) IC1.19(AGND_5) IC1.20(TOCAP)
NetC8_2: C8.2 R20.1 R21.1 R22.2 R23.2
NetC9_1: C9.1 IC2.23(PH0) Y2.1
NetC10_1: C10.1 IC2.24(PH1) Y2.2
NetC11_1: C11.1 IC3.23(PH0) Y3.1
NetC12_1: C12.1 IC3.24(PH1) Y3.2
NetC13_1: C13.1 IC4.23(PH0) Y4.1
NetC14_1: C14.1 IC4.24(PH1) Y4.2
NetC15_1: C15.1 IC5.23(PH0) Y5.1
NetC16_1: C16.1 IC5.24(PH1) Y5.2
NetC17_1: C17.1 IC6.23(PH0) Y6.1
NetC18_1: C18.1 IC6.24(PH1) Y6.2
NetC19_1: C19.1 IC7.23(PH0) Y7.1
NetC20_1: C20.1 IC7.24(PH1) Y7.2
NetC90_2: C90.2 C92.1 L1.2 PS1.2(+VIN(Vcc))
NetIC1_10: IC1.10(EXRES1) R18.2
NetIC1_22: IC1.22(1V2O) R19.2
NetIC1_38: IC1.38(RSVD_2) R5.1
NetIC1_39: IC1.39(RSVD_3) R4.1
NetIC1_40: IC1.40(RSVD_4) R3.1
NetIC1_41: IC1.41(RSVD_5) R2.1
NetIC1_42: IC1.42(RSVD_6) R1.1
NetJ1_1: J1.1 P1.16(TX+)
NetJ1_2: J1.2 P1.14(TX-)
NetJ1_3: J1.3 P1.11(RX+)
NetJ1_4: J1.4 J1.5 R22.1
NetJ1_6: J1.6 P1.9(RX-)
NetJ1_7: J1.7 J1.8 R23.1
NetJ1_9: J1.9(YELLOW_CATHODE) R24.1
NetJ1_11: J1.11(GREEN_C) R25.1
NetL1_1: L1.1 P10.1
NetP1_1: P1.1(TD+) R8.1 R13.1
NetP1_3: P1.3(TD-) R7.1 R11.1
NetP1_10: P1.10(RXCT) R21.2
NetP1_15: P1.15(TXCT) R20.2
NetR40_1: R40.1 R41.2 S3.1(COM_1) S3.2(COM_2)

Not connected (* = marked no-connect by the designer): IC1 7(DNC) 12(NC_1) 13(NC_2) 18(VBG) 23(RSVD_1) 24(SPDLED) 26(DUPLED) 46(NC_3) 47(NC_4); IC2 3(PE4) 6(VBAT) 14(PF4) 15(PF5) 18(PF6) 22(PF10) 26(PC0) 27(PC1) 34(PA0) 35(PA1) 36(PA2) 37(PA3) 40(PA4) 44(PC4) 45(PC5) 49(PF11) 50(PF12) 53(PF13) 54(PF14) 55(PF15) 56(PG0) 57(PG1) 58(PE7) 59(PE8) 60(PE9) 63(PE10) 64(PE11) 65(PE12) 66(PE13) 67(PE14) 68(PE15) 71(VCAP_1) 73(PB12) 74(PB13) 75(PB14) 76(PB15) 77(PD8) 78(PD9) 79(PD10) 80(PD11) 81(PD12) 82(PD13) 85(PD14) 86(PD15) 87(PG2) 88(PG3) 89(PG4) 90(PG5) 91(PG6) 92(PG7) 93(PG8) 96(PC6) 97(PC7) 98(PC8) 99(PC9) 100(PA8) 103(PA11) 104(PA12) 106(VCAP_2) 110(PA15) 114(PD0) 115(PD1) 116(PD2) 117(PD3) 118(PD4) 119(PD5) 122(PD6) 123(PD7) 124(PG9) 125(PG10) 126(PG11) 132(PG15) 133(PB3) 134(PB4) 135(PB5) 136(PB6) 137(PB7) 139(PB8) 140(PB9) 141(PE0) 142(PE1) 143(PDR_ON); IC3 3(PE4) 6(VBAT) 7(PC13) 8(PC14) 9(PC15) 10(PF0) 11(PF1) 12(PF2) 13(PF3) 14(PF4) 15(PF5) 18(PF6) 22(PF10) 26(PC0) 27(PC1) 34(PA0) 35(PA1) 36(PA2) 37(PA3) 40(PA4) 44(PC4) 45(PC5) 46(PB0) 47(PB1) 49(PF11) 50(PF12) 53(PF13) 54(PF14) 55(PF15) 56(PG0) 57(PG1) 58(PE7) 59(PE8) 60(PE9) 63(PE10) 64(PE11) 65(PE12) 66(PE13) 67(PE14) 68(PE15) 70(PB11) 71(VCAP_1) 73(PB12) 74(PB13) 75(PB14) 76(PB15) 77(PD8) 78(PD9) 79(PD10) 80(PD11) 81(PD12) 82(PD13) 85(PD14) 86(PD15) 87(PG2) 88(PG3) 89(PG4) 90(PG5) 91(PG6) 92(PG7) 93(PG8) 96(PC6) 97(PC7) 98(PC8) 99(PC9) 100(PA8) 101(PA9) 102(PA10) 103(PA11) 104(PA12) 106(VCAP_2) 110(PA15) 114(PD0) 115(PD1) 116(PD2) 117(PD3) 118(PD4) 119(PD5) 122(PD6) 123(PD7) 124(PG9) 125(PG10) 126(PG11) 132(PG15) 133(PB3) 134(PB4) 135(PB5) 136(PB6) 137(PB7) 139(PB8) 140(PB9) 141(PE0) 142(PE1) 143(PDR_ON); IC4 3(PE4) 6(VBAT) 7(PC13) 8(PC14) 9(PC15) 10(PF0) 11(PF1) 12(PF2) 13(PF3) 14(PF4) 15(PF5) 18(PF6) 22(PF10) 26(PC0) 27(PC1) 34(PA0) 35(PA1) 36(PA2) 37(PA3) 40(PA4) 44(PC4) 45(PC5) 46(PB0) 47(PB1) 49(PF11) 50(PF12) 53(PF13) 54(PF14) 55(PF15) 56(PG0) 57(PG1) 58(PE7) 59(PE8) 60(PE9) 63(PE10) 64(PE11) 65(PE12) 66(PE13) 67(PE14) 68(PE15) 70(PB11) 71(VCAP_1) 73(PB12) 74(PB13) 75(PB14) 76(PB15) 77(PD8) 78(PD9) 79(PD10) 80(PD11) 81(PD12) 82(PD13) 85(PD14) 86(PD15) 87(PG2) 88(PG3) 89(PG4) 90(PG5) 91(PG6) 92(PG7) 93(PG8) 96(PC6) 97(PC7) 98(PC8) 99(PC9) 100(PA8) 101(PA9) 102(PA10) 103(PA11) 104(PA12) 106(VCAP_2) 110(PA15) 114(PD0) 115(PD1) 116(PD2) 117(PD3) 118(PD4) 119(PD5) 122(PD6) 123(PD7) 124(PG9) 125(PG10) 126(PG11) 132(PG15) 133(PB3) 134(PB4) 135(PB5) 136(PB6) 137(PB7) 139(PB8) 140(PB9) 141(PE0) 142(PE1) 143(PDR_ON); IC5 3(PE4) 6(VBAT) 7(PC13) 8(PC14) 9(PC15) 10(PF0) 11(PF1) 12(PF2) 13(PF3) 14(PF4) 15(PF5) 18(PF6) 22(PF10) 26(PC0) 27(PC1) 34(PA0) 35(PA1) 36(PA2) 37(PA3) 40(PA4) 44(PC4) 45(PC5) 46(PB0) 47(PB1) 49(PF11) 50(PF12) 53(PF13) 54(PF14) 55(PF15) 56(PG0) 57(PG1) 58(PE7) 59(PE8) 60(PE9) 63(PE10) 64(PE11) 65(PE12) 66(PE13) 67(PE14) 68(PE15) 70(PB11) 71(VCAP_1) 73(PB12) 74(PB13) 75(PB14) 76(PB15) 77(PD8) 78(PD9) 79(PD10) 80(PD11) 81(PD12) 82(PD13) 85(PD14) 86(PD15) 87(PG2) 88(PG3) 89(PG4) 90(PG5) 91(PG6) 92(PG7) 93(PG8) 96(PC6) 97(PC7) 98(PC8) 99(PC9) 100(PA8) 101(PA9) 102(PA10) 103(PA11) 104(PA12) 106(VCAP_2) 110(PA15) 114(PD0) 115(PD1) 116(PD2) 117(PD3) 118(PD4) 119(PD5) 122(PD6) 123(PD7) 124(PG9) 125(PG10) 126(PG11) 132(PG15) 133(PB3) 134(PB4) 135(PB5) 136(PB6) 137(PB7) 139(PB8) 140(PB9) 141(PE0) 142(PE1) 143(PDR_ON); IC6 3(PE4) 6(VBAT) 7(PC13) 8(PC14) 9(PC15) 10(PF0) 11(PF1) 12(PF2) 13(PF3) 14(PF4) 15(PF5) 18(PF6) 22(PF10) 26(PC0) 27(PC1) 34(PA0) 35(PA1) 36(PA2) 37(PA3) 40(PA4) 44(PC4) 45(PC5) 46(PB0) 47(PB1) 49(PF11) 50(PF12) 53(PF13) 54(PF14) 55(PF15) 56(PG0) 57(PG1) 58(PE7) 59(PE8) 60(PE9) 63(PE10) 64(PE11) 65(PE12) 66(PE13) 67(PE14) 68(PE15) 70(PB11) 71(VCAP_1) 73(PB12) 74(PB13) 75(PB14) 76(PB15) 77(PD8) 78(PD9) 79(PD10) 80(PD11) 81(PD12) 82(PD13) 85(PD14) 86(PD15) 87(PG2) 88(PG3) 89(PG4) 90(PG5) 91(PG6) 92(PG7) 93(PG8) 96(PC6) 97(PC7) 98(PC8) 99(PC9) 100(PA8) 101(PA9) 102(PA10) 103(PA11) 104(PA12) 106(VCAP_2) 110(PA15) 114(PD0) 115(PD1) 116(PD2) 117(PD3) 118(PD4) 119(PD5) 122(PD6) 123(PD7) 124(PG9) 125(PG10) 126(PG11) 132(PG15) 133(PB3) 134(PB4) 135(PB5) 136(PB6) 137(PB7) 139(PB8) 140(PB9) 141(PE0) 142(PE1) 143(PDR_ON); IC7 3(PE4) 6(VBAT) 7(PC13) 8(PC14) 9(PC15) 10(PF0) 11(PF1) 12(PF2) 13(PF3) 14(PF4) 15(PF5) 18(PF6) 22(PF10) 26(PC0) 27(PC1) 34(PA0) 35(PA1) 36(PA2) 37(PA3) 40(PA4) 44(PC4) 45(PC5) 46(PB0) 47(PB1) 49(PF11) 50(PF12) 53(PF13) 54(PF14) 55(PF15) 56(PG0) 57(PG1) 58(PE7) 59(PE8) 60(PE9) 63(PE10) 64(PE11) 65(PE12) 66(PE13) 67(PE14) 68(PE15) 70(PB11) 71(VCAP_1) 73(PB12) 74(PB13) 75(PB14) 76(PB15) 77(PD8) 78(PD9) 79(PD10) 80(PD11) 81(PD12) 82(PD13) 85(PD14) 86(PD15) 87(PG2) 88(PG3) 89(PG4) 90(PG5) 91(PG6) 92(PG7) 93(PG8) 96(PC6) 97(PC7) 98(PC8) 99(PC9) 100(PA8) 101(PA9) 102(PA10) 103(PA11) 104(PA12) 106(VCAP_2) 110(PA15) 114(PD0) 115(PD1) 116(PD2) 117(PD3) 118(PD4) 119(PD5) 122(PD6) 123(PD7) 124(PG9) 125(PG10) 126(PG11) 132(PG15) 133(PB3) 134(PB4) 135(PB5) 136(PB6) 137(PB7) 139(PB8) 140(PB9) 141(PE0) 142(PE1) 143(PDR_ON); IC8 4(NC); IC9 4(NC); IC10 4(NC); IC11 4(NC); J1 13(MNT_1) 14(MNT_2); P1 4 5 12 13; PS1 3(Remote) 8(NC) 9(Case) 10(Case)

### Notes on the sheet
- Ethernet
- RJ45
- (near S1) PushButton
- S2_BOOT
- S3_BOOT
- S4_BOOT
- S5_BOOT
- S6_BOOT
- Temperatur
- Slave_Reset
- BOOT1
- X
- BOOT0
- 0
- MODE
- FLASH
- PushButton
- 1
- SRAM
- ISP
- (near P3) STLink_Slave
- (near P2) STLink_Master
- (near S3) PushButton
- M_Reset
- (near P10) GND
- 1210
- (near P9) Serial_Port
- (near P10) +24v
- (near C90) 1210
- (near C92) 1210
- BOOT
- Back_up_Master
- DCDC Wandler

### Library data of the parts
C1 C3 C4 = CAP NP: Capacitor non polarized; cm1: Tụ điện dán 0603; cm2: Tụ điện dán 0805; cm3: Tụ điện dán 1206
  C1: Value: 10nF
C2 C5 C6 C8 = CAP NP: Capacitor non polarized; cm1: Tụ điện dán 0603; cm3: Tụ điện dán 1206; cm2: Tụ điện dán 0805
C7 = Cap: Capacitor; Published: 8-Jun-2000; LatestRevisionDate: 17-Jul-2002; LatestRevisionNote: Re-released for DXP Platform.; PackageReference: RAD-0.3; Publisher: Altium Limited; PackageDescription: Radial Cap, Thru-Hole; 2 Leads; 0.3 in Pin Spacing
C9-C20 = CP1: Value: 30pF
C21-C86 = Cap_0805
C87 C88 C90-C92 = C
  C87 C88: Value: 100nF
  C90: Value: 10uF
  C91 C92: Value: 1nF
IC1 = W5500: Integrated Circuit; Manufacturer_Name: Wiznet Technology; Datasheet Link: https://www.arrow.com/en/products/w5500/wiznet; Height: 1.6mm; Manufacturer_Part_Number: W5500; Arrow Part Number: W5500; Arrow Price/Stock: https://www.arrow.com/en/products/w5500/wiznet
IC2-IC7 = STM32F429ZGT6: Integrated Circuit; Manufacturer_Name: STMicroelectronics; Datasheet Link: http://www.st.com/web/en/resource/technical/document/datasheet/DM00071990.pdf; Height: 1.6mm; Manufacturer_Part_Number: STM32F429ZGT6; Mouser Part Number: 511-STM32F429ZGT6; Mouser Price/Stock: https://www.mouser.co.uk/ProductDetail/STMicroelectronics/STM32F429ZGT6?qs=DqCdCwOw4%2F61O51evUvYMQ%3D%3D; Arrow Part Number: STM32F429ZGT6; Arrow Price/Stock: https://www.arrow.com/en/products/stm32f429zgt6/stmicroelectronics
IC8-IC11 = DS18B20+T&R: Integrated Circuit; Manufacturer_Name: Maxim Integrated; Datasheet Link: https://componentsearchengine.com/Datasheets/1/DS18B20+T&R.pdf; Height: 10.41mm; Manufacturer_Part_Number: DS18B20+T&R; Mouser Part Number: 700-DS18B20T&R; Mouser Price/Stock: https://www.mouser.co.uk/ProductDetail/Maxim-Integrated/DS18B20%2bTR/?qs=7H2Jq%252ByxpJKpIDCbiq4lfg%3D%3D
L1 = Inductor: SimulationGenericComponent: True
P2 P3 P9 P11 = MHDR1X4: Header, 4-Pin; LatestRevisionDate: 17-Jul-2002; LatestRevisionNote: Re-released for DXP Platform.; Publisher: Altium Limited
P4-P8 = MHDR2X10: Header, 10-Pin, Dual row; LatestRevisionDate: 17-Jul-2002; LatestRevisionNote: Re-released for DXP Platform.; Publisher: Altium Limited
P10 = MHDR1X2: Header, 2-Pin; LatestRevisionDate: 17-Jul-2002; LatestRevisionNote: Re-released for DXP Platform.; Publisher: Altium Limited
PS1 = TMR 6-2410WIR: DCDC Wandler
R1-R25 = Res2: Resistor; Published: 8-Jun-2000; LatestRevisionDate: 17-Jul-2002; LatestRevisionNote: Re-released for DXP Platform.; PackageReference: AXIAL-0.4; Publisher: Altium Limited; PackageDescription: Axial Device, Thru-Hole; 2 Leads; 0.4 in Pin Spacing
  R1-R5 R12 R15 R19: Value: 1K
  R8: Value: 49R
  R9 R10: Value: 82R
  R13 R14 R16: Value: 33R
  R17: Value: 1M
  R18: Value: 10K
  R20-R23: Value: 75R
R26-R42 = R
  R26 R32-R36 R39 R41 R42: Value: 10K
  R27-R31 R40: Value: 100K
  R37 R38: Value: 10k
S1-S3 = B3F-1025: Switch; Manufacturer_Name: Omron Electronics; Datasheet Link: http://uk.rs-online.com/web/p/products/6821140; Height: 5.2mm; Manufacturer_Part_Number: B3F-1025; Mouser Part Number: 653-B3F-1025; Mouser Price/Stock: https://www.mouser.co.uk/ProductDetail/Omron-Electronics/B3F-1025?qs=1tDaWCEHQQ7ZoQQuZXPfLw%3D%3D
Y1 = ABM3-25.000MHZ-B2-T: Crystal or Oscillator; Manufacturer_Name: ABRACON; Datasheet Link: https://datasheet.datasheetarchive.com/originals/distributors/SFDatasheet-0/sf-000246.pdf; Height: 1.3mm; Manufacturer_Part_Number: ABM3-25.000MHZ-B2-T; Arrow Part Number: ABM3-25.000MHZ-B2-T; Arrow Price/Stock: https://www.arrow.com/en/products/abm3-25.000mhz-b2-t/abracon; Mouser Part Number: 815-ABM3-25-B2-T; Mouser Price/Stock: https://www.mouser.co.uk/ProductDetail/ABRACON/ABM3-25000MHZ-B2-T?qs=GgB7MJ%2FTIsQBQ7HNZGW3Hg%3D%3D
Y2-Y7 = ATS08ASM-1E: Crystal or Oscillator; Manufacturer_Name: CTS; Datasheet Link: https://www.ctscorp.com/wp-content/uploads/ATS-ATSSM.pdf; Height: 4.3mm; Manufacturer_Part_Number: ATS08ASM-1E; Arrow Part Number: ATS08ASM-1E; Arrow Price/Stock: https://www.arrow.com/en/products/ats08asm-1e/cts; Mouser Part Number: 774-ATS08ASM-1E; Mouser Price/Stock: https://www.mouser.co.uk/ProductDetail/CTS-Electronic-Components/ATS08ASM-1E/?qs=tjlMjqRIEYSoOC%2FyJ4%2Frjw%3D%3D